# Altium schematic sheet PIC18F27K42-I_ML.SchDoc: 8-bit Microcontroller
size A4; DrawnBy: Isaque Sá; Organization: CeNTI; Address1: Rua Fernando Mesquita 2785; Address2: Vila Nova de Famalicão; Address3: 4760-034, Portugal; DocumentNumber: 1; Revision: 0; SheetNumber: 3; SheetTotal: 4; Project: AM2R- Safe2Wheels; ProjectName: Smart Systems - Hardware
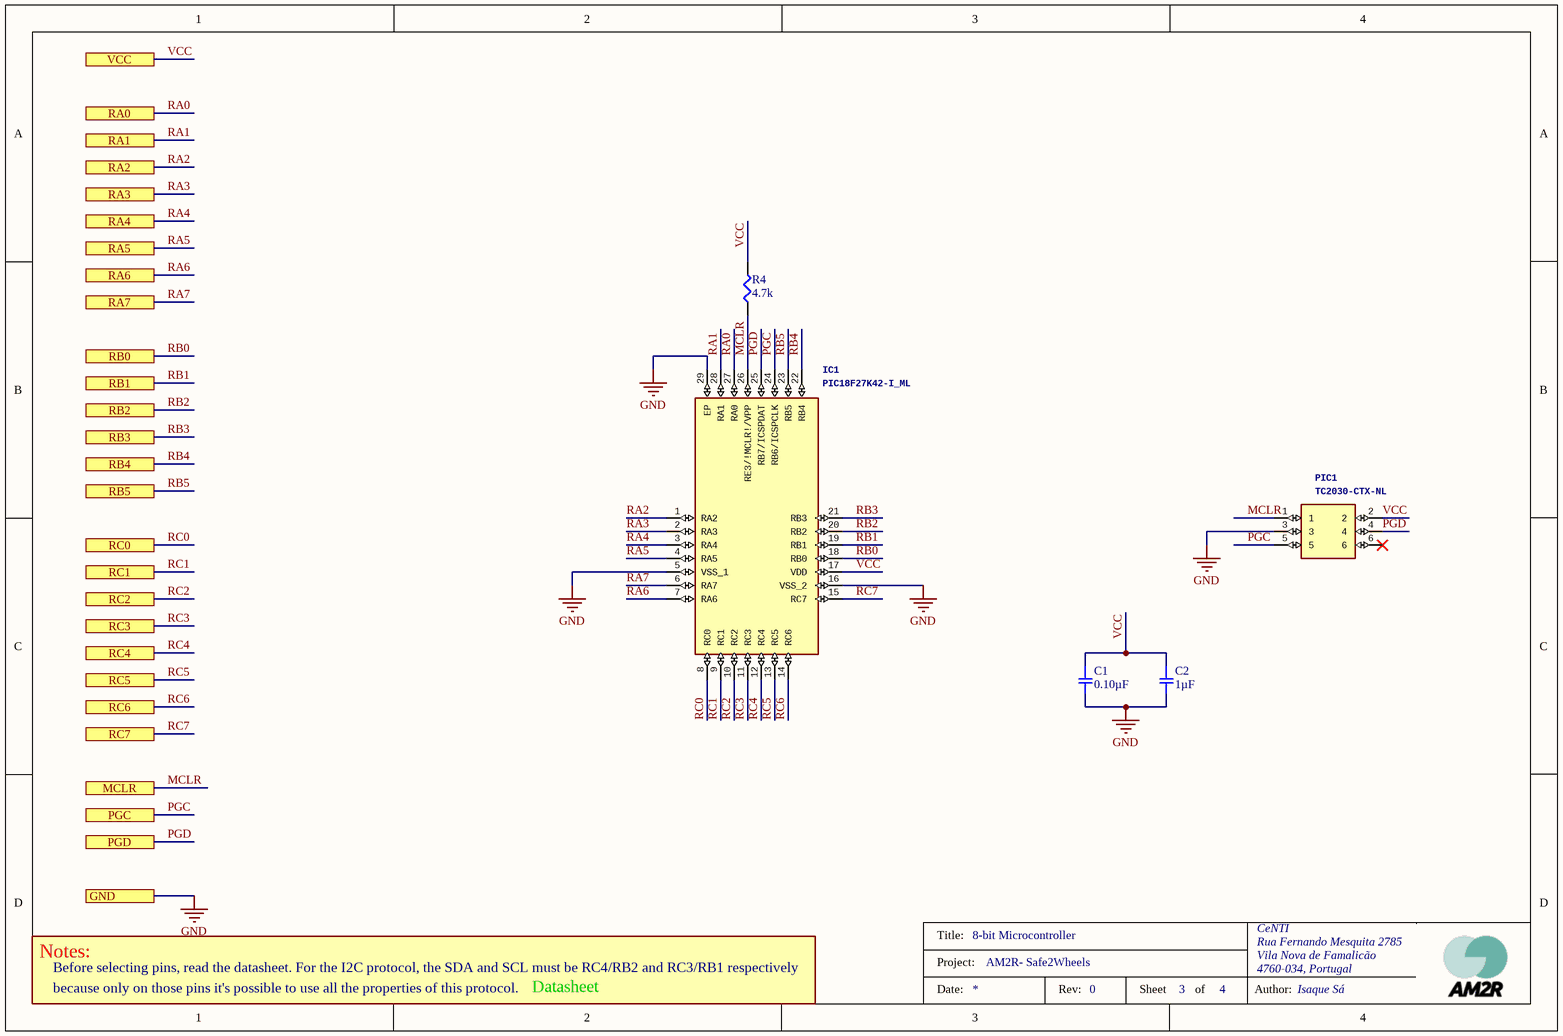
[diagram p0: PIC18F27K42-I_ML.SchDoc]

## Parts
C1  0.10µF  [SMD-0402C]
C2  1µF  [SMD-0402C]
IC1  PIC18F27K42-I_ML  [QFN28_6x6]
PIC1  TC2030-CTX-NL  [TC2030]
R4  4.7k  [SMD-0402-RES]

## Ports
GND, MCLR, PGC, PGD, RA0, RA1, RA2, RA3, RA4, RA5, RA6, RA7, RB0, RB1, RB2, RB3, RB4, RB5, RC0, RC1, RC2, RC3, RC4, RC5, RC6, RC7, VCC

## Nets
GND: C1.2 C2.2 IC1.5(VSS_1) IC1.16(VSS_2) IC1.29(EP) PIC1.3 ; port GND
MCLR: IC1.26(RE3/!MCLR!/VPP) PIC1.1 R4.1 ; port MCLR
PGC: IC1.24(RB6/ICSPCLK) PIC1.5 ; port PGC
PGD: IC1.25(RB7/ICSPDAT) PIC1.4 ; port PGD
RA0: IC1.27(RA0) ; port RA0
RA1: IC1.28(RA1) ; port RA1
RA2: IC1.1(RA2) ; port RA2
RA3: IC1.2(RA3) ; port RA3
RA4: IC1.3(RA4) ; port RA4
RA5: IC1.4(RA5) ; port RA5
RA6: IC1.7(RA6) ; port RA6
RA7: IC1.6(RA7) ; port RA7
RB0: IC1.18(RB0) ; port RB0
RB1: IC1.19(RB1) ; port RB1
RB2: IC1.20(RB2) ; port RB2
RB3: IC1.21(RB3) ; port RB3
RB4: IC1.22(RB4) ; port RB4
RB5: IC1.23(RB5) ; port RB5
RC0: IC1.8(RC0) ; port RC0
RC1: IC1.9(RC1) ; port RC1
RC2: IC1.10(RC2) ; port RC2
RC3: IC1.11(RC3) ; port RC3
RC4: IC1.12(RC4) ; port RC4
RC5: IC1.13(RC5) ; port RC5
RC6: IC1.14(RC6) ; port RC6
RC7: IC1.15(RC7) ; port RC7
VCC: C1.1 C2.1 IC1.17(VDD) PIC1.2 R4.2 ; port VCC

Not connected (* = marked no-connect by the designer): PIC1 6*

## Notes on the sheet
- Notes:
- Before selecting pins, read the datasheet. For the I2C protocol, the SDA and SCL must be RC4/RB2 and RC3/RB1 respectively
- because only on those pins it's possible to use all the properties of this protocol.
- Datasheet <http://ww1.microchip.com/downloads/en/DeviceDoc/Microchip%208bit%20mcu%20%20PIC18%20L_F26_27_45_46_47_55_56_57K42%20low-power%20high-performance%20mcu%20with%20xlp%20tech%2040001919B.pdf>
- Title:
- Project:
- Date:
- Rev:
- Sheet
- of
- Author:

## Library data of the parts
C1 = GCM155R71C104KA55D: CAP CER 0.1UF 16V X7R 0402; Manufacturer: Murata Electronics North America; Factory Stock: 0; Unit Price (USD): 0.1; Minimum Quantity: 1; Tolerance: ±10%; Datasheets: http://www.murata.com/~/media/webrenewal/support/library/catalog/products/capacitor/mlcc/c03e.ashx; Image: //media.digikey.com/Renders/Murata%20Renders/ZRB-SERIES-0402.jpg; Digi-Key Part Number: 490-4759-1-ND; Part Number: GCM155R71C104KA55D; Quantity Available: 734194; @ qty: 0; Packaging: Cut Tape (CT); Series: GCM; Part Status: Active; Value: 0.10µF; Voltage: 16V; Temperature Coefficient: X7R; Operating Temperature: -55°C ~ 125°C; Features: -; Ratings: AEC-Q200; Applications: Automotive; Mounting Type: Surface Mount, MLCC; Package / Case: 0402 (1005 Metric); Size / Dimension: 0.039" L x 0.020" W (1.00mm x 0.50mm); Height - Seated (Max): -; Thickness (Max): 0.022" (0.55mm); Lead Spacing: -; Lead Style: -
C2 = GCM155C71A105KE38D: CAP CER 1UF 10V X7S 0402; Manufacturer: Murata Electronics North America; Factory Stock: 0; Unit Price (USD): 0.12; Minimum Quantity: 1; Tolerance: ±10%; Datasheets: http://www.murata.com/~/media/webrenewal/support/library/catalog/products/capacitor/mlcc/c03e.ashx; Image: //media.digikey.com/Renders/Murata%20Renders/ZRB-SERIES-0402.jpg; Digi-Key Part Number: 490-13409-1-ND; Part Number: GCM155C71A105KE38D; Quantity Available: 7240; @ qty: 0; Packaging: Cut Tape (CT); Series: GCM; Part Status: Active; Value: 1µF; Voltage: 10V; Temperature Coefficient: X7S; Operating Temperature: -55°C ~ 125°C; Features: -; Ratings: AEC-Q200; Applications: Automotive; Mounting Type: Surface Mount, MLCC; Package / Case: 0402 (1005 Metric); Size / Dimension: 0.039" L x 0.020" W (1.00mm x 0.50mm); Height - Seated (Max): -; Thickness (Max): 0.022" (0.55mm); Lead Spacing: -; Lead Style: -
IC1 = PIC18F27K42-I_ML: 8-bit Microcontrollers; Manufacturer_Name: Microchip; Manufacturer_Part_Number: PIC18F27K42-I/ML; GateName_1: G$1; SymbolName_1: PIC18F27K42-I_ML; LibraryName: PIC18F27K42-I_ML; DeviceSetName: PIC18F27K42-I_ML; Mouser_Part_Number: 579-PIC18F27K42-I/ML; Mouser_Price-Stock: https://www.mouser.com/Search/Refine.aspx?Keyword=579-PIC18F27K42-I%2FML; Height: 1mm
PIC1 = TC2030-CTX-NL: 6-Pin "No Legs" Cable with 10-pin micro-connector for Cortex processors; Manufacturer_Name: Tag Connect; GateName_1: G$1; SymbolName_1: TC2030-CTX-NL; LibraryName: TC2030-CTX-NL; DeviceSetName: TC2030-CTX-NL; Manufacturer_Part_Number: TC2030-CTX-NL; Height: 18mm
R4 = ERJ-2RKF4701X: RES SMD 4.7K OHM 1% 1/10W 0402; Manufacturer: Panasonic Electronic Components; Factory Stock: 0; Unit Price (USD): 0.00496; @ qty: 1500; Minimum Quantity: 1; Power (Watts): 0.1W, 1/10W; Temperature Coefficient: ±100ppm/°C; Part Number: ERJ-2RKF4701X; Datasheets: http://industrial.panasonic.com/www-cgi/jvcr13pz.cgi?E+PZ+3+AOA0002+ERJ2RKF4701X+7+WW; Image: //media.digikey.com/Photos/Panasonic%20Photos/ERJ-PA2-Series.jpg; Digi-Key Part Number: P4.70KLCT-ND; Quantity Available: 1881807; Packaging: Cut Tape (CT); Series: ERJ; Part Status: Active; Value: 4.7k; Tolerance: ±1%; Composition: Thick Film; Features: Automotive AEC-Q200; Operating Temperature: -55°C ~ 155°C; Package / Case: 0402 (1005 Metric); Supplier Device Package: 0402; Size / Dimension: 0.039" L x 0.020" W (1.00mm x 0.50mm); Height - Seated (Max): 0.016" (0.40mm); Number of Terminations: 2; Failure Rate: -